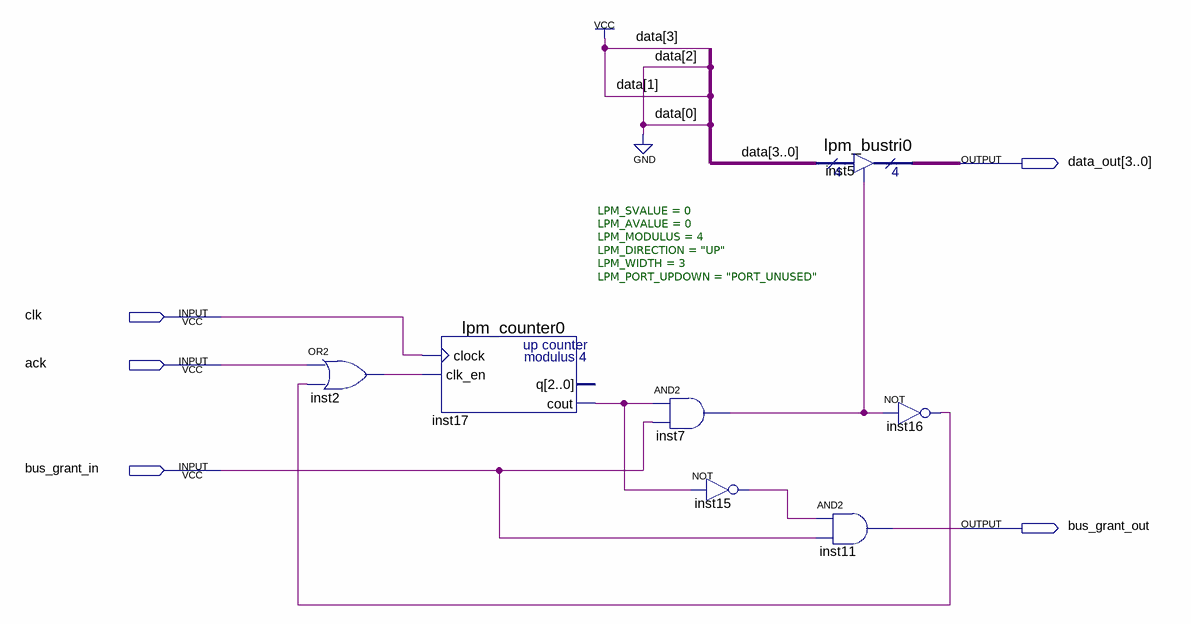
[diagram p0: schematic sheet]
// Quartus schematic master_block_2.bdf as structural Verilog: 7 symbols, 5 pins
module master_block_2 (
  input  clk,
  input  ack,
  input  bus_grant_in,
  output [3:0] data_out,
  output bus_grant_out
);

  wire inst2_out, inst7_out, inst15_out, inst16_out, inst17_cout;

  or inst2 (inst2_out, ack, inst16_out);
  lpm_counter0 #(.LPM_SVALUE(0), .LPM_AVALUE(0), .LPM_MODULUS(4), .LPM_DIRECTION("UP"), .LPM_WIDTH(3), .LPM_PORT_UPDOWN("PORT_UNUSED")) inst17 (
    .clock(clk), .clk_en(inst2_out), .cout(inst17_cout));  // open: q
  and inst7 (inst7_out, inst17_cout, bus_grant_in);
  not inst15 (inst15_out, inst17_cout);
  lpm_bustri0 inst5 (.enabledt(inst7_out), .data(4'b1010), .tridata(data_out));
  and inst11 (bus_grant_out, inst15_out, bus_grant_in);
  not inst16 (inst16_out, inst7_out);
endmodule
